# Altium schematic sheet Sheet1.SchDoc
size A4
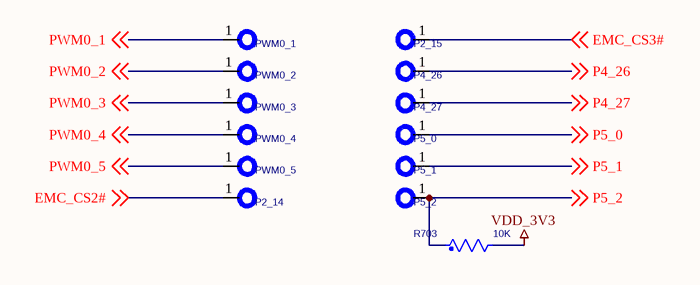
[diagram p0: Sheet1.SchDoc]

## Parts
R703  10K
TP700  PWM0_1
TP701  P2_14
TP702  PWM0_5
TP703  PWM0_3
TP704  PWM0_2
TP705  PWM0_4
TP706  P4_26
TP707  P5_0
TP708  P5_1
TP709  P4_27
TP710  P2_15
TP711  P5_2

## Nets
VDD_3V3: R703.2
EMC_CS2#: TP701.1 ; off-sheet EMC_CS2#
EMC_CS3#: TP710.1 ; off-sheet EMC_CS3#
P4_26: TP706.1 ; off-sheet P4_26
P4_27: TP709.1 ; off-sheet P4_27
P5_0: TP707.1 ; off-sheet P5_0
P5_1: TP708.1 ; off-sheet P5_1
P5_2: R703.1 TP711.1 ; off-sheet P5_2
PWM0_1: TP700.1 ; off-sheet PWM0_1
PWM0_2: TP704.1 ; off-sheet PWM0_2
PWM0_3: TP703.1 ; off-sheet PWM0_3
PWM0_4: TP705.1 ; off-sheet PWM0_4
PWM0_5: TP702.1 ; off-sheet PWM0_5

## Library data of the parts
R703 = R_Generic_Dup2
TP700-TP711 = TestPoint_1